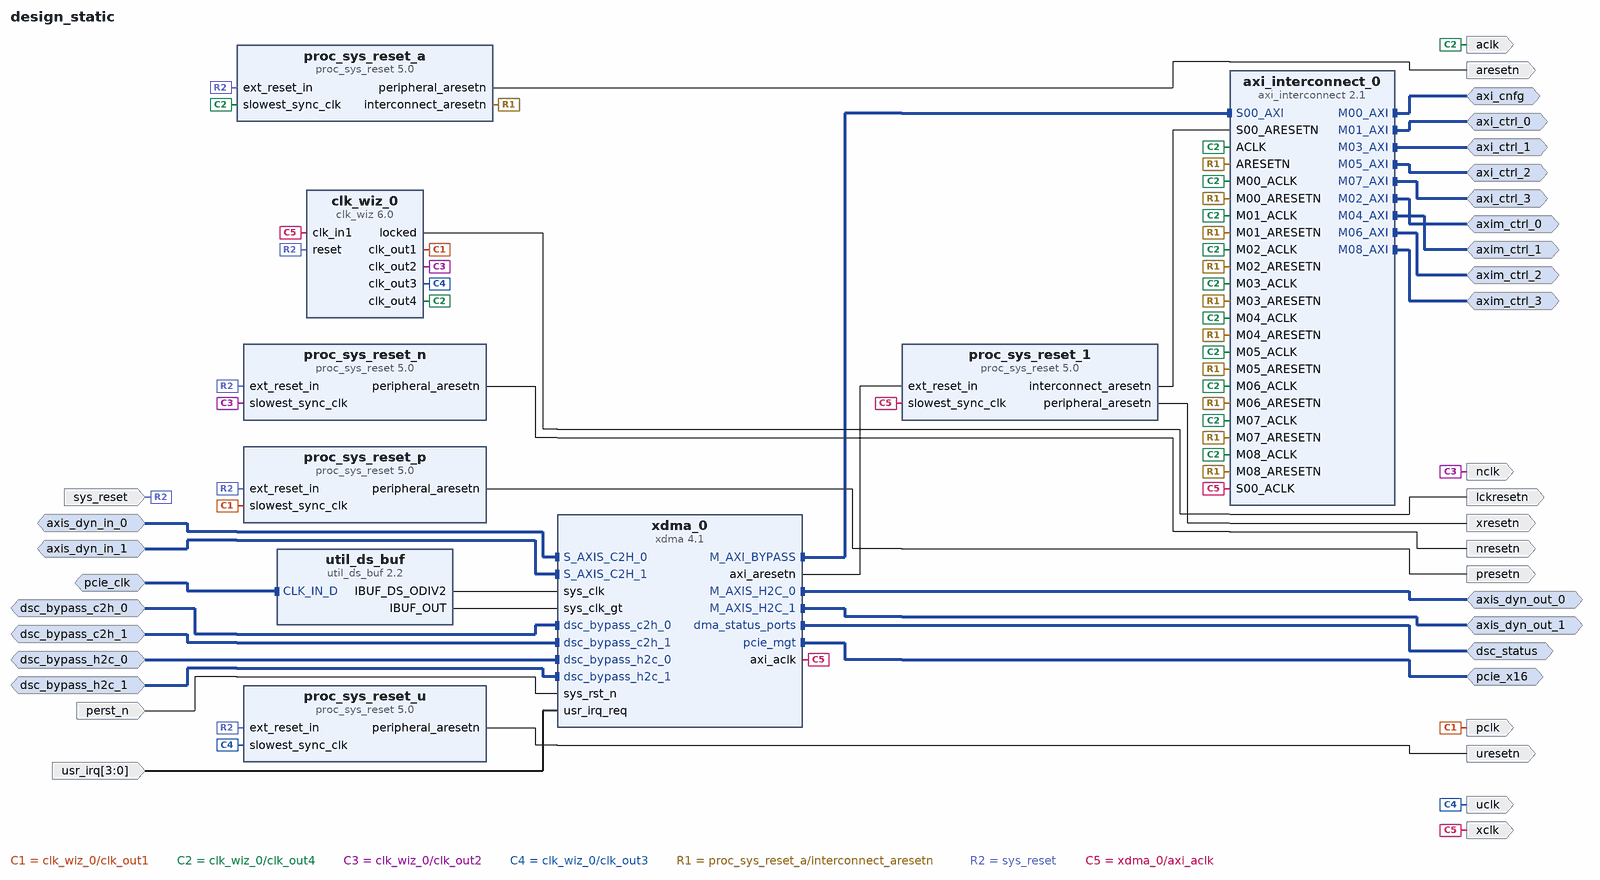
[diagram p0: block diagram of the top level]
# Vivado block design design_static, xcvu9p-flga2104-2L-e, Vivado 2022.2
create_bd_design design_static

create_bd_intf_port -mode Master -vlnv xilinx.com:interface:aximm_rtl:1.0 axi_cnfg
set_property -dict {CONFIG.ADDR_WIDTH 64 CONFIG.DATA_WIDTH 64 CONFIG.PROTOCOL AXI4LITE} [get_bd_intf_ports axi_cnfg]
create_bd_intf_port -mode Master -vlnv xilinx.com:display_xdma:xdma_status_ports_rtl:1.0 dsc_status
create_bd_intf_port -mode Slave -vlnv xilinx.com:interface:diff_clock_rtl:1.0 pcie_clk
set_property -dict {CONFIG.FREQ_HZ 100000000} [get_bd_intf_ports pcie_clk]
create_bd_intf_port -mode Master -vlnv xilinx.com:interface:pcie_7x_mgt_rtl:1.0 pcie_x16
create_bd_intf_port -mode Slave -vlnv xilinx.com:interface:axis_rtl:1.0 axis_dyn_in_0
set_property -dict [list \
  CONFIG.HAS_TKEEP 1 \
  CONFIG.HAS_TLAST 1 \
  CONFIG.HAS_TREADY 1 \
  CONFIG.HAS_TSTRB 0 \
  CONFIG.LAYERED_METADATA undef \
  CONFIG.TDATA_NUM_BYTES 64 \
  CONFIG.TDEST_WIDTH 0 \
  CONFIG.TID_WIDTH 0 \
  CONFIG.TUSER_WIDTH 0 \
] [get_bd_intf_ports axis_dyn_in_0]
create_bd_intf_port -mode Master -vlnv xilinx.com:interface:axis_rtl:1.0 axis_dyn_out_0
create_bd_intf_port -mode Slave -vlnv xilinx.com:display_xdma:dsc_bypass_rtl:1.0 dsc_bypass_c2h_0
create_bd_intf_port -mode Slave -vlnv xilinx.com:display_xdma:dsc_bypass_rtl:1.0 dsc_bypass_h2c_0
create_bd_intf_port -mode Slave -vlnv xilinx.com:interface:axis_rtl:1.0 axis_dyn_in_1
set_property -dict [list \
  CONFIG.HAS_TKEEP 1 \
  CONFIG.HAS_TLAST 1 \
  CONFIG.HAS_TREADY 1 \
  CONFIG.HAS_TSTRB 0 \
  CONFIG.LAYERED_METADATA undef \
  CONFIG.TDATA_NUM_BYTES 64 \
  CONFIG.TDEST_WIDTH 0 \
  CONFIG.TID_WIDTH 0 \
  CONFIG.TUSER_WIDTH 0 \
] [get_bd_intf_ports axis_dyn_in_1]
create_bd_intf_port -mode Master -vlnv xilinx.com:interface:axis_rtl:1.0 axis_dyn_out_1
create_bd_intf_port -mode Slave -vlnv xilinx.com:display_xdma:dsc_bypass_rtl:1.0 dsc_bypass_c2h_1
create_bd_intf_port -mode Slave -vlnv xilinx.com:display_xdma:dsc_bypass_rtl:1.0 dsc_bypass_h2c_1
create_bd_intf_port -mode Master -vlnv xilinx.com:interface:aximm_rtl:1.0 axi_ctrl_0
set_property -dict {CONFIG.ADDR_WIDTH 64 CONFIG.DATA_WIDTH 64 CONFIG.PROTOCOL AXI4LITE} [get_bd_intf_ports axi_ctrl_0]
create_bd_intf_port -mode Master -vlnv xilinx.com:interface:aximm_rtl:1.0 axi_ctrl_1
set_property -dict {CONFIG.ADDR_WIDTH 64 CONFIG.DATA_WIDTH 64 CONFIG.PROTOCOL AXI4LITE} [get_bd_intf_ports axi_ctrl_1]
create_bd_intf_port -mode Master -vlnv xilinx.com:interface:aximm_rtl:1.0 axi_ctrl_2
set_property -dict {CONFIG.ADDR_WIDTH 64 CONFIG.DATA_WIDTH 64 CONFIG.PROTOCOL AXI4LITE} [get_bd_intf_ports axi_ctrl_2]
create_bd_intf_port -mode Master -vlnv xilinx.com:interface:aximm_rtl:1.0 axi_ctrl_3
set_property -dict {CONFIG.ADDR_WIDTH 64 CONFIG.DATA_WIDTH 64 CONFIG.PROTOCOL AXI4LITE} [get_bd_intf_ports axi_ctrl_3]
create_bd_intf_port -mode Master -vlnv xilinx.com:interface:aximm_rtl:1.0 axim_ctrl_0
set_property -dict [list \
  CONFIG.ADDR_WIDTH 64 \
  CONFIG.DATA_WIDTH 256 \
  CONFIG.HAS_BRESP 1 \
  CONFIG.HAS_BURST 1 \
  CONFIG.HAS_CACHE 1 \
  CONFIG.HAS_LOCK 1 \
  CONFIG.HAS_PROT 1 \
  CONFIG.HAS_QOS 0 \
  CONFIG.HAS_REGION 0 \
  CONFIG.HAS_RRESP 1 \
  CONFIG.HAS_WSTRB 1 \
  CONFIG.NUM_READ_OUTSTANDING 8 \
  CONFIG.NUM_WRITE_OUTSTANDING 8 \
  CONFIG.PROTOCOL AXI4 \
  CONFIG.READ_WRITE_MODE READ_WRITE \
] [get_bd_intf_ports axim_ctrl_0]
create_bd_intf_port -mode Master -vlnv xilinx.com:interface:aximm_rtl:1.0 axim_ctrl_1
set_property -dict [list \
  CONFIG.ADDR_WIDTH 64 \
  CONFIG.DATA_WIDTH 256 \
  CONFIG.HAS_BRESP 1 \
  CONFIG.HAS_BURST 1 \
  CONFIG.HAS_CACHE 1 \
  CONFIG.HAS_LOCK 1 \
  CONFIG.HAS_PROT 1 \
  CONFIG.HAS_QOS 0 \
  CONFIG.HAS_REGION 0 \
  CONFIG.HAS_RRESP 1 \
  CONFIG.HAS_WSTRB 1 \
  CONFIG.NUM_READ_OUTSTANDING 8 \
  CONFIG.NUM_WRITE_OUTSTANDING 8 \
  CONFIG.PROTOCOL AXI4 \
  CONFIG.READ_WRITE_MODE READ_WRITE \
] [get_bd_intf_ports axim_ctrl_1]
create_bd_intf_port -mode Master -vlnv xilinx.com:interface:aximm_rtl:1.0 axim_ctrl_2
set_property -dict [list \
  CONFIG.ADDR_WIDTH 64 \
  CONFIG.DATA_WIDTH 256 \
  CONFIG.HAS_BRESP 1 \
  CONFIG.HAS_BURST 1 \
  CONFIG.HAS_CACHE 1 \
  CONFIG.HAS_LOCK 1 \
  CONFIG.HAS_PROT 1 \
  CONFIG.HAS_QOS 0 \
  CONFIG.HAS_REGION 0 \
  CONFIG.HAS_RRESP 1 \
  CONFIG.HAS_WSTRB 1 \
  CONFIG.NUM_READ_OUTSTANDING 8 \
  CONFIG.NUM_WRITE_OUTSTANDING 8 \
  CONFIG.PROTOCOL AXI4 \
  CONFIG.READ_WRITE_MODE READ_WRITE \
] [get_bd_intf_ports axim_ctrl_2]
create_bd_intf_port -mode Master -vlnv xilinx.com:interface:aximm_rtl:1.0 axim_ctrl_3
set_property -dict [list \
  CONFIG.ADDR_WIDTH 64 \
  CONFIG.DATA_WIDTH 256 \
  CONFIG.HAS_BRESP 1 \
  CONFIG.HAS_BURST 1 \
  CONFIG.HAS_CACHE 1 \
  CONFIG.HAS_LOCK 1 \
  CONFIG.HAS_PROT 1 \
  CONFIG.HAS_QOS 0 \
  CONFIG.HAS_REGION 0 \
  CONFIG.HAS_RRESP 1 \
  CONFIG.HAS_WSTRB 1 \
  CONFIG.NUM_READ_OUTSTANDING 8 \
  CONFIG.NUM_WRITE_OUTSTANDING 8 \
  CONFIG.PROTOCOL AXI4 \
  CONFIG.READ_WRITE_MODE READ_WRITE \
] [get_bd_intf_ports axim_ctrl_3]
create_bd_port -dir O -type rst aresetn
create_bd_port -dir O -type clk aclk
set_property -dict [list \
  CONFIG.ASSOCIATED_BUSIF axi_cnfg:axi_ctrl_0:axi_ctrl_1:axi_ctrl_2:axi_ctrl_3:axim_ctrl_0:axim_ctrl_1:axim_ctrl_2:axim_ctrl_3 \
  CONFIG.ASSOCIATED_RESET aresetn \
] [get_bd_ports aclk]
create_bd_port -dir O -type rst xresetn
create_bd_port -dir O -type clk xclk
set_property -dict [list \
  CONFIG.ASSOCIATED_BUSIF axis_dyn_out_0:axis_dyn_in_0:axis_dyn_out_1:axis_dyn_in_1 \
  CONFIG.ASSOCIATED_RESET xresetn:xresetn \
] [get_bd_ports xclk]
create_bd_port -dir O -type rst nresetn
create_bd_port -dir O -type clk nclk
set_property -dict {CONFIG.ASSOCIATED_RESET nresetn} [get_bd_ports nclk]
create_bd_port -dir O -type rst uresetn
create_bd_port -dir O -type clk uclk
set_property -dict {CONFIG.ASSOCIATED_RESET uresetn} [get_bd_ports uclk]
create_bd_port -dir O -type rst presetn
create_bd_port -dir O -type clk pclk
set_property -dict {CONFIG.ASSOCIATED_RESET presetn} [get_bd_ports pclk]
create_bd_port -dir I -type rst perst_n
set_property -dict {CONFIG.POLARITY ACTIVE_LOW} [get_bd_ports perst_n]
create_bd_port -dir I -type rst sys_reset
set_property -dict {CONFIG.POLARITY ACTIVE_HIGH} [get_bd_ports sys_reset]
create_bd_port -dir I -from 3 -to 0 -type intr usr_irq
set_property -dict {CONFIG.PortWidth 4} [get_bd_ports usr_irq]
create_bd_port -dir O -type rst lckresetn

create_bd_cell -type ip -vlnv xilinx.com:ip:axi_interconnect:2.1 axi_interconnect_0
set_property -dict [list \
  CONFIG.M00_HAS_REGSLICE 4 \
  CONFIG.M01_HAS_REGSLICE 4 \
  CONFIG.M02_HAS_REGSLICE 4 \
  CONFIG.M03_HAS_REGSLICE 4 \
  CONFIG.M04_HAS_REGSLICE 4 \
  CONFIG.M05_HAS_REGSLICE 4 \
  CONFIG.M06_HAS_REGSLICE 4 \
  CONFIG.M07_HAS_REGSLICE 4 \
  CONFIG.M08_HAS_REGSLICE 4 \
  CONFIG.NUM_MI 9 \
  CONFIG.S00_HAS_DATA_FIFO 2 \
  CONFIG.S00_HAS_REGSLICE 4 \
  CONFIG.STRATEGY 2 \
] [get_bd_cells axi_interconnect_0]
create_bd_cell -type ip -vlnv xilinx.com:ip:clk_wiz:6.0 clk_wiz_0
set_property -dict [list \
  CONFIG.CLKOUT1_DRIVES Buffer \
  CONFIG.CLKOUT1_JITTER 82.933 \
  CONFIG.CLKOUT1_REQUESTED_OUT_FREQ 200.000 \
  CONFIG.CLKOUT2_DRIVES Buffer \
  CONFIG.CLKOUT2_JITTER 79.446 \
  CONFIG.CLKOUT2_PHASE_ERROR 72.667 \
  CONFIG.CLKOUT2_REQUESTED_OUT_FREQ 250 \
  CONFIG.CLKOUT2_USED true \
  CONFIG.CLKOUT3_DRIVES Buffer \
  CONFIG.CLKOUT3_JITTER 76.708 \
  CONFIG.CLKOUT3_PHASE_ERROR 72.667 \
  CONFIG.CLKOUT3_REQUESTED_OUT_FREQ 300 \
  CONFIG.CLKOUT3_USED true \
  CONFIG.CLKOUT4_DRIVES Buffer \
  CONFIG.CLKOUT4_JITTER 76.708 \
  CONFIG.CLKOUT4_PHASE_ERROR 72.667 \
  CONFIG.CLKOUT4_REQUESTED_OUT_FREQ 300 \
  CONFIG.CLKOUT4_USED true \
  CONFIG.CLKOUT5_DRIVES Buffer \
  CONFIG.CLKOUT6_DRIVES Buffer \
  CONFIG.CLKOUT7_DRIVES Buffer \
  CONFIG.MMCM_CLKOUT0_DIVIDE_F 7.500 \
  CONFIG.MMCM_CLKOUT1_DIVIDE 6 \
  CONFIG.MMCM_CLKOUT2_DIVIDE 5 \
  CONFIG.MMCM_CLKOUT3_DIVIDE 5 \
  CONFIG.NUM_OUT_CLKS 4 \
  CONFIG.OPTIMIZE_CLOCKING_STRUCTURE_EN true \
  CONFIG.PRIM_IN_FREQ 250.000 \
  CONFIG.PRIM_SOURCE Single_ended_clock_capable_pin \
  CONFIG.SECONDARY_SOURCE Single_ended_clock_capable_pin \
  CONFIG.USE_PHASE_ALIGNMENT true \
] [get_bd_cells clk_wiz_0]
create_bd_cell -type ip -vlnv xilinx.com:ip:proc_sys_reset:5.0 proc_sys_reset_1
create_bd_cell -type ip -vlnv xilinx.com:ip:proc_sys_reset:5.0 proc_sys_reset_p
create_bd_cell -type ip -vlnv xilinx.com:ip:proc_sys_reset:5.0 proc_sys_reset_n
create_bd_cell -type ip -vlnv xilinx.com:ip:proc_sys_reset:5.0 proc_sys_reset_u
create_bd_cell -type ip -vlnv xilinx.com:ip:proc_sys_reset:5.0 proc_sys_reset_a
create_bd_cell -type ip -vlnv xilinx.com:ip:util_ds_buf:2.2 util_ds_buf
set_property -dict {CONFIG.C_BUF_TYPE IBUFDSGTE} [get_bd_cells util_ds_buf]
create_bd_cell -type ip -vlnv xilinx.com:ip:xdma:4.1 xdma_0
set_property -dict [list \
  CONFIG.PF0_DEVICE_ID_mqdma 903F \
  CONFIG.PF2_DEVICE_ID_mqdma 903F \
  CONFIG.PF3_DEVICE_ID_mqdma 903F \
  CONFIG.axi_bypass_64bit_en true \
  CONFIG.axi_bypass_prefetchable true \
  CONFIG.axi_data_width 512_bit \
  CONFIG.axi_id_width 4 \
  CONFIG.axist_bypass_en true \
  CONFIG.axist_bypass_scale Gigabytes \
  CONFIG.axist_bypass_size 1 \
  CONFIG.axisten_freq 250 \
  CONFIG.cfg_mgmt_if false \
  CONFIG.dsc_bypass_rd 0011 \
  CONFIG.dsc_bypass_wr 0011 \
  CONFIG.pcie_blk_locn X1Y2 \
  CONFIG.pf0_base_class_menu Memory_controller \
  CONFIG.pf0_class_code_base 05 \
  CONFIG.pf0_class_code_interface 00 \
  CONFIG.pf0_class_code_sub 80 \
  CONFIG.pf0_device_id 903F \
  CONFIG.pf0_msi_cap_multimsgcap 32_vectors \
  CONFIG.pf0_msix_cap_pba_offset 00008FE0 \
  CONFIG.pf0_msix_cap_table_offset 00008000 \
  CONFIG.pf0_msix_cap_table_size 01F \
  CONFIG.pf0_msix_enabled true \
  CONFIG.pf0_sub_class_interface_menu Other_memory_controller \
  CONFIG.pl_link_cap_max_link_speed 8.0_GT/s \
  CONFIG.pl_link_cap_max_link_width X16 \
  CONFIG.xdma_axi_intf_mm AXI_Stream \
  CONFIG.xdma_num_usr_irq 4 \
  CONFIG.xdma_rnum_chnl 2 \
  CONFIG.xdma_rnum_rids 32 \
  CONFIG.xdma_sts_ports true \
  CONFIG.xdma_wnum_chnl 2 \
  CONFIG.xdma_wnum_rids 32 \
] [get_bd_cells xdma_0]

# ---- connections ----

connect_bd_intf_net [get_bd_intf_ports axi_cnfg] [get_bd_intf_pins axi_interconnect_0/M00_AXI]
connect_bd_intf_net [get_bd_intf_ports axi_ctrl_0] [get_bd_intf_pins axi_interconnect_0/M01_AXI]
connect_bd_intf_net [get_bd_intf_ports axim_ctrl_0] [get_bd_intf_pins axi_interconnect_0/M02_AXI]
connect_bd_intf_net [get_bd_intf_ports axi_ctrl_1] [get_bd_intf_pins axi_interconnect_0/M03_AXI]
connect_bd_intf_net [get_bd_intf_ports axim_ctrl_1] [get_bd_intf_pins axi_interconnect_0/M04_AXI]
connect_bd_intf_net [get_bd_intf_ports axi_ctrl_2] [get_bd_intf_pins axi_interconnect_0/M05_AXI]
connect_bd_intf_net [get_bd_intf_ports axim_ctrl_2] [get_bd_intf_pins axi_interconnect_0/M06_AXI]
connect_bd_intf_net [get_bd_intf_ports axi_ctrl_3] [get_bd_intf_pins axi_interconnect_0/M07_AXI]
connect_bd_intf_net [get_bd_intf_ports axim_ctrl_3] [get_bd_intf_pins axi_interconnect_0/M08_AXI]
connect_bd_intf_net -intf_net axis_dyn_in_0_1 [get_bd_intf_ports axis_dyn_in_0] [get_bd_intf_pins xdma_0/S_AXIS_C2H_0]
connect_bd_intf_net -intf_net axis_dyn_in_1_1 [get_bd_intf_ports axis_dyn_in_1] [get_bd_intf_pins xdma_0/S_AXIS_C2H_1]
connect_bd_intf_net -intf_net diff_clock_rtl_0_1 [get_bd_intf_ports pcie_clk] [get_bd_intf_pins util_ds_buf/CLK_IN_D]
connect_bd_intf_net -intf_net dsc_bypass_c2h_0_1 [get_bd_intf_ports dsc_bypass_c2h_0] [get_bd_intf_pins xdma_0/dsc_bypass_c2h_0]
connect_bd_intf_net -intf_net dsc_bypass_c2h_1_1 [get_bd_intf_ports dsc_bypass_c2h_1] [get_bd_intf_pins xdma_0/dsc_bypass_c2h_1]
connect_bd_intf_net -intf_net dsc_bypass_h2c_0_1 [get_bd_intf_ports dsc_bypass_h2c_0] [get_bd_intf_pins xdma_0/dsc_bypass_h2c_0]
connect_bd_intf_net -intf_net dsc_bypass_h2c_1_1 [get_bd_intf_ports dsc_bypass_h2c_1] [get_bd_intf_pins xdma_0/dsc_bypass_h2c_1]
connect_bd_intf_net [get_bd_intf_ports axis_dyn_out_0] [get_bd_intf_pins xdma_0/M_AXIS_H2C_0]
connect_bd_intf_net [get_bd_intf_ports axis_dyn_out_1] [get_bd_intf_pins xdma_0/M_AXIS_H2C_1]
connect_bd_intf_net [get_bd_intf_pins axi_interconnect_0/S00_AXI] [get_bd_intf_pins xdma_0/M_AXI_BYPASS]
connect_bd_intf_net [get_bd_intf_ports dsc_status] [get_bd_intf_pins xdma_0/dma_status_ports]
connect_bd_intf_net [get_bd_intf_ports pcie_x16] [get_bd_intf_pins xdma_0/pcie_mgt]
connect_bd_net -net a_aresetn_1 [get_bd_pins proc_sys_reset_a/peripheral_aresetn] [get_bd_ports aresetn]
connect_bd_net [get_bd_pins clk_wiz_0/clk_out1] [get_bd_ports pclk] [get_bd_pins proc_sys_reset_p/slowest_sync_clk]
connect_bd_net [get_bd_pins clk_wiz_0/clk_out4] \
  [get_bd_ports aclk] [get_bd_pins proc_sys_reset_a/slowest_sync_clk] [get_bd_pins axi_interconnect_0/ACLK] \
  [get_bd_pins axi_interconnect_0/M00_ACLK] [get_bd_pins axi_interconnect_0/M01_ACLK] \
  [get_bd_pins axi_interconnect_0/M02_ACLK] [get_bd_pins axi_interconnect_0/M03_ACLK] \
  [get_bd_pins axi_interconnect_0/M04_ACLK] [get_bd_pins axi_interconnect_0/M05_ACLK] \
  [get_bd_pins axi_interconnect_0/M06_ACLK] [get_bd_pins axi_interconnect_0/M07_ACLK] \
  [get_bd_pins axi_interconnect_0/M08_ACLK]
connect_bd_net [get_bd_pins clk_wiz_0/clk_out2] [get_bd_ports nclk] [get_bd_pins proc_sys_reset_n/slowest_sync_clk]
connect_bd_net [get_bd_pins clk_wiz_0/clk_out3] [get_bd_ports uclk] [get_bd_pins proc_sys_reset_u/slowest_sync_clk]
connect_bd_net [get_bd_pins clk_wiz_0/locked] [get_bd_ports lckresetn]
connect_bd_net -net n_aresetn_1 [get_bd_pins proc_sys_reset_n/peripheral_aresetn] [get_bd_ports nresetn]
connect_bd_net -net p_aresetn_1 [get_bd_pins proc_sys_reset_p/peripheral_aresetn] [get_bd_ports presetn]
connect_bd_net [get_bd_pins proc_sys_reset_1/interconnect_aresetn] [get_bd_pins axi_interconnect_0/S00_ARESETN]
connect_bd_net [get_bd_pins proc_sys_reset_1/peripheral_aresetn] [get_bd_ports xresetn]
connect_bd_net [get_bd_pins proc_sys_reset_a/interconnect_aresetn] \
  [get_bd_pins axi_interconnect_0/ARESETN] [get_bd_pins axi_interconnect_0/M00_ARESETN] \
  [get_bd_pins axi_interconnect_0/M01_ARESETN] [get_bd_pins axi_interconnect_0/M02_ARESETN] \
  [get_bd_pins axi_interconnect_0/M03_ARESETN] [get_bd_pins axi_interconnect_0/M04_ARESETN] \
  [get_bd_pins axi_interconnect_0/M05_ARESETN] [get_bd_pins axi_interconnect_0/M06_ARESETN] \
  [get_bd_pins axi_interconnect_0/M07_ARESETN] [get_bd_pins axi_interconnect_0/M08_ARESETN]
connect_bd_net -net reset_rtl_0_1 [get_bd_ports perst_n] [get_bd_pins xdma_0/sys_rst_n]
connect_bd_net [get_bd_ports sys_reset] \
  [get_bd_pins clk_wiz_0/reset] [get_bd_pins proc_sys_reset_p/ext_reset_in] [get_bd_pins proc_sys_reset_u/ext_reset_in] \
  [get_bd_pins proc_sys_reset_n/ext_reset_in] [get_bd_pins proc_sys_reset_a/ext_reset_in]
connect_bd_net -net u_aresetn_1 [get_bd_pins proc_sys_reset_u/peripheral_aresetn] [get_bd_ports uresetn]
connect_bd_net [get_bd_ports usr_irq] [get_bd_pins xdma_0/usr_irq_req]
connect_bd_net [get_bd_pins util_ds_buf/IBUF_DS_ODIV2] [get_bd_pins xdma_0/sys_clk]
connect_bd_net [get_bd_pins util_ds_buf/IBUF_OUT] [get_bd_pins xdma_0/sys_clk_gt]
connect_bd_net [get_bd_pins xdma_0/axi_aclk] \
  [get_bd_pins clk_wiz_0/clk_in1] [get_bd_ports xclk] [get_bd_pins proc_sys_reset_1/slowest_sync_clk] \
  [get_bd_pins axi_interconnect_0/S00_ACLK]
connect_bd_net -net xdma_0_axi_aresetn_ns [get_bd_pins xdma_0/axi_aresetn] [get_bd_pins proc_sys_reset_1/ext_reset_in]

# ---- address map ----
assign_bd_address -offset 0x0000000000000000 -range 32K -target_address_space [get_bd_addr_spaces xdma_0/M_AXI_BYPASS] [get_bd_addr_segs axi_cnfg/Reg]
assign_bd_address -offset 0x0000000000100000 -range 256K -target_address_space [get_bd_addr_spaces xdma_0/M_AXI_BYPASS] [get_bd_addr_segs axi_ctrl_0/Reg]
assign_bd_address -offset 0x0000000000140000 -range 256K -target_address_space [get_bd_addr_spaces xdma_0/M_AXI_BYPASS] [get_bd_addr_segs axi_ctrl_1/Reg]
assign_bd_address -offset 0x0000000000180000 -range 256K -target_address_space [get_bd_addr_spaces xdma_0/M_AXI_BYPASS] [get_bd_addr_segs axi_ctrl_2/Reg]
assign_bd_address -offset 0x00000000001C0000 -range 256K -target_address_space [get_bd_addr_spaces xdma_0/M_AXI_BYPASS] [get_bd_addr_segs axi_ctrl_3/Reg]
assign_bd_address -offset 0x0000000001000000 -range 256K -target_address_space [get_bd_addr_spaces xdma_0/M_AXI_BYPASS] [get_bd_addr_segs axim_ctrl_0/Reg]
assign_bd_address -offset 0x0000000001040000 -range 256K -target_address_space [get_bd_addr_spaces xdma_0/M_AXI_BYPASS] [get_bd_addr_segs axim_ctrl_1/Reg]
assign_bd_address -offset 0x0000000001080000 -range 256K -target_address_space [get_bd_addr_spaces xdma_0/M_AXI_BYPASS] [get_bd_addr_segs axim_ctrl_2/Reg]
assign_bd_address -offset 0x00000000010C0000 -range 256K -target_address_space [get_bd_addr_spaces xdma_0/M_AXI_BYPASS] [get_bd_addr_segs axim_ctrl_3/Reg]

validate_bd_design
save_bd_design
